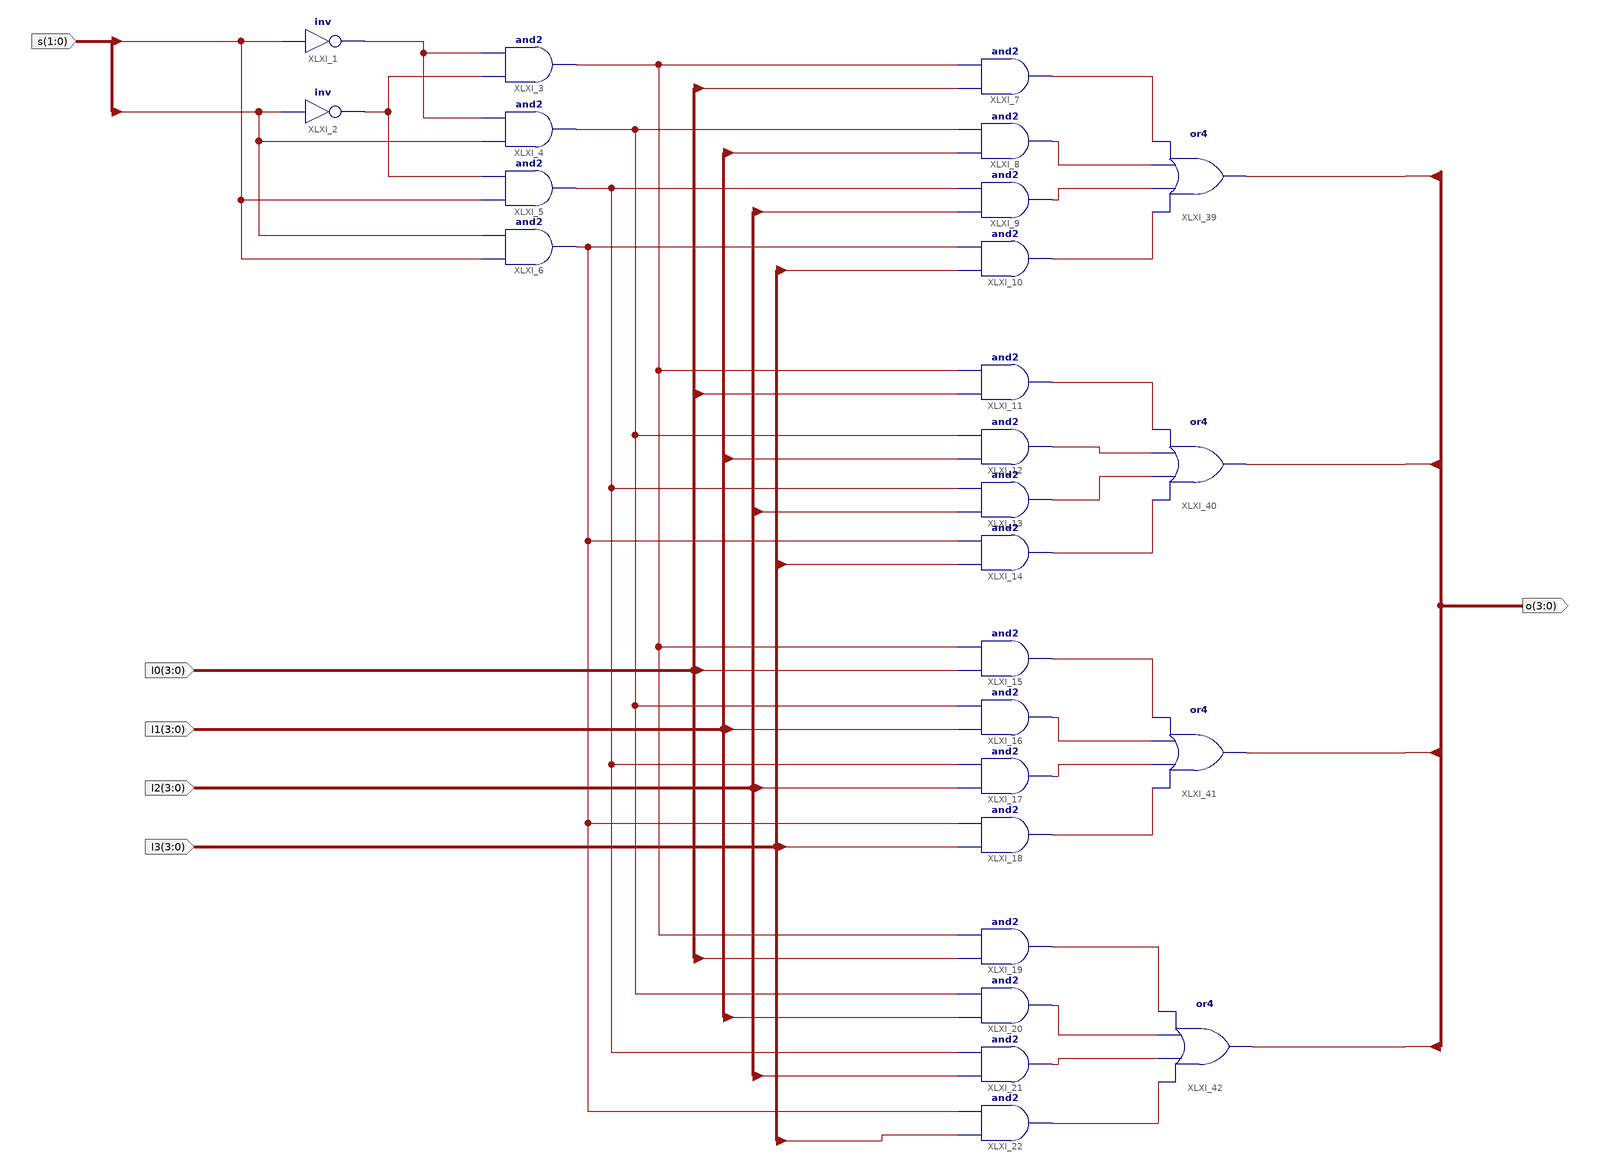
[diagram p0: schematic sheet 1]
// Xilinx ISE schematic MUX4T1_4.sch (kintex7) as structural Verilog: 26 symbols, 6 ports
module MUX4T1_4 (
  input  [1:0] s,
  input  [3:0] I0,
  input  [3:0] I1,
  input  [3:0] I2,
  input  [3:0] I3,
  output [3:0] o
);

  wire XLXN_7, XLXN_9, XLXN_23, XLXN_26, XLXN_29, XLXN_32, XLXN_70, XLXN_71, XLXN_72, XLXN_73, XLXN_74,
       XLXN_75, XLXN_76, XLXN_77, XLXN_78, XLXN_79, XLXN_81, XLXN_82, XLXN_83, XLXN_84, XLXN_85, XLXN_86;

  not XLXI_1 (XLXN_7, s[1]);
  not XLXI_2 (XLXN_9, s[0]);
  and XLXI_3 (XLXN_32, XLXN_9, XLXN_7);
  and XLXI_4 (XLXN_29, s[0], XLXN_7);
  and XLXI_5 (XLXN_26, s[1], XLXN_9);
  and XLXI_6 (XLXN_23, s[1], s[0]);
  and XLXI_7 (XLXN_70, I0[0], XLXN_32);
  and XLXI_8 (XLXN_71, I1[0], XLXN_29);
  and XLXI_9 (XLXN_72, I2[0], XLXN_26);
  and XLXI_10 (XLXN_73, I3[0], XLXN_23);
  and XLXI_11 (XLXN_74, I0[1], XLXN_32);
  and XLXI_12 (XLXN_75, I1[1], XLXN_29);
  and XLXI_13 (XLXN_76, I2[1], XLXN_26);
  and XLXI_14 (XLXN_77, I3[1], XLXN_23);
  and XLXI_15 (XLXN_78, I0[2], XLXN_32);
  and XLXI_16 (XLXN_79, I1[2], XLXN_29);
  and XLXI_17 (XLXN_81, I2[2], XLXN_26);
  and XLXI_18 (XLXN_82, I3[2], XLXN_23);
  and XLXI_19 (XLXN_83, I0[3], XLXN_32);
  and XLXI_20 (XLXN_84, I1[3], XLXN_29);
  and XLXI_21 (XLXN_85, I2[3], XLXN_26);
  and XLXI_22 (XLXN_86, I3[3], XLXN_23);
  or XLXI_39 (o[0], XLXN_73, XLXN_72, XLXN_71, XLXN_70);
  or XLXI_40 (o[1], XLXN_77, XLXN_76, XLXN_75, XLXN_74);
  or XLXI_41 (o[2], XLXN_82, XLXN_81, XLXN_79, XLXN_78);
  or XLXI_42 (o[3], XLXN_86, XLXN_85, XLXN_84, XLXN_83);
endmodule
